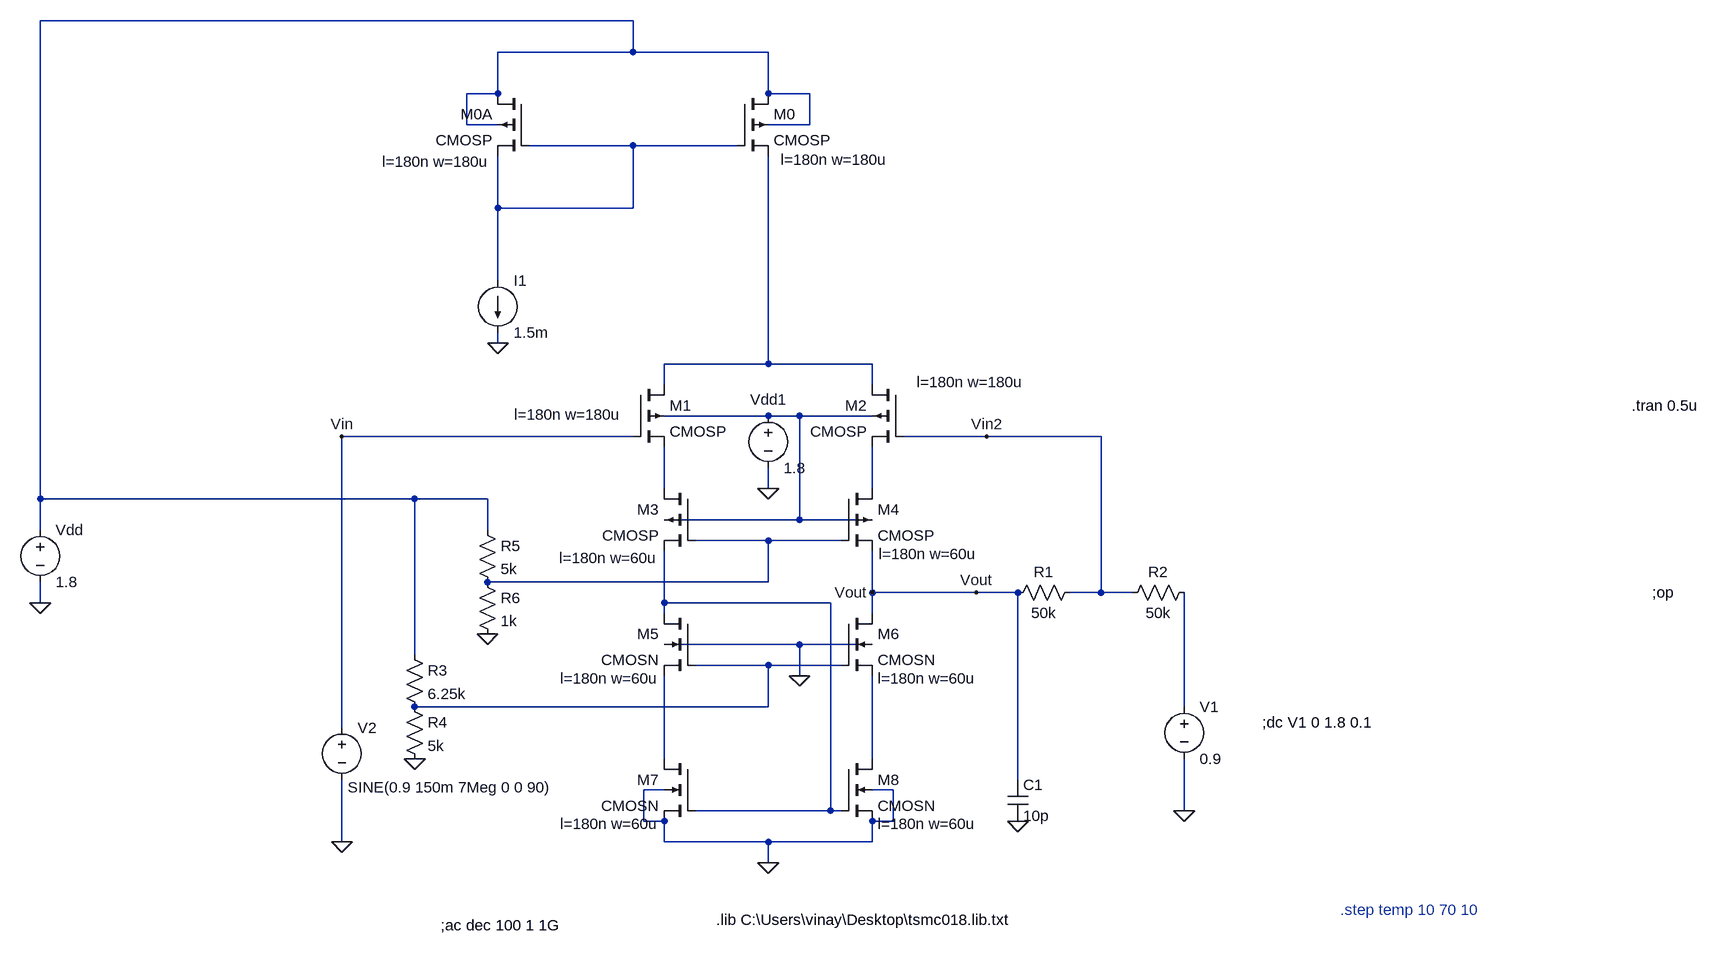
[diagram p0: schematic Differential_Amplifier.asc]
Differential_Amplifier.asc, the LTspice schematic file:
Version 4
SHEET 1 2008 752
WIRE -32 -784 -944 -784
WIRE -32 -736 -32 -784
WIRE -32 -736 -240 -736
WIRE 176 -736 -32 -736
WIRE -240 -672 -240 -736
WIRE -240 -672 -288 -672
WIRE 176 -672 176 -736
WIRE 240 -672 176 -672
WIRE -288 -624 -288 -672
WIRE -240 -624 -288 -624
WIRE 240 -624 240 -672
WIRE 240 -624 176 -624
WIRE -32 -592 -192 -592
WIRE 128 -592 -32 -592
WIRE -240 -496 -240 -576
WIRE -32 -496 -32 -592
WIRE -32 -496 -240 -496
WIRE -240 -384 -240 -496
WIRE -240 -288 -240 -304
WIRE 176 -256 176 -576
WIRE 176 -256 16 -256
WIRE 336 -256 176 -256
WIRE 16 -224 16 -256
WIRE 336 -224 336 -256
WIRE 176 -176 16 -176
WIRE 224 -176 176 -176
WIRE 336 -176 224 -176
WIRE -32 -144 -480 -144
WIRE 512 -144 384 -144
WIRE 688 -144 512 -144
WIRE 16 -64 16 -128
WIRE 176 -64 176 -96
WIRE 336 -64 336 -128
WIRE -944 -48 -944 -784
WIRE -368 -48 -944 -48
WIRE -256 -48 -368 -48
WIRE 224 -16 224 -176
WIRE 224 -16 16 -16
WIRE 336 -16 224 -16
WIRE -944 0 -944 -48
WIRE -256 0 -256 -48
WIRE 176 16 64 16
WIRE 288 16 176 16
WIRE 176 80 176 16
WIRE 176 80 -256 80
WIRE 336 96 336 32
WIRE 496 96 336 96
WIRE 560 96 496 96
WIRE 688 96 688 -144
WIRE 688 96 640 96
WIRE 736 96 688 96
WIRE -944 112 -944 80
WIRE 16 112 16 32
WIRE 272 112 16 112
WIRE 16 128 16 112
WIRE 336 128 336 96
WIRE 224 176 16 176
WIRE 336 176 224 176
WIRE -368 192 -368 -48
WIRE 176 208 64 208
WIRE 288 208 176 208
WIRE 224 224 224 176
WIRE 176 272 176 208
WIRE 176 272 -368 272
WIRE 816 272 816 96
WIRE -480 304 -480 -144
WIRE 16 352 16 224
WIRE 336 352 336 224
WIRE 560 384 560 96
WIRE 16 400 -16 400
WIRE 368 400 336 400
WIRE 272 432 272 112
WIRE 272 432 64 432
WIRE 288 432 272 432
WIRE 816 432 816 352
WIRE -16 448 -16 400
WIRE 16 448 -16 448
WIRE 368 448 368 400
WIRE 368 448 336 448
WIRE -480 480 -480 384
WIRE 16 480 16 448
WIRE 176 480 16 480
WIRE 336 480 336 448
WIRE 336 480 176 480
WIRE 176 512 176 480
FLAG 176 512 0
FLAG -944 112 0
FLAG 176 -64 0
FLAG 560 448 0
FLAG -480 480 0
FLAG 816 432 0
FLAG -240 -288 0
FLAG 224 224 0
FLAG -368 352 0
FLAG -256 160 0
FLAG -480 -144 Vin
FLAG 336 96 Vout
FLAG 496 96 Vout
FLAG 512 -144 Vin2
DATAFLAG -144 -144 ""
DATAFLAG -240 -496 ""
DATAFLAG 176 -320 ""
DATAFLAG 192 16 ""
DATAFLAG 336 -80 ""
DATAFLAG 16 -80 ""
DATAFLAG 336 80 ""
DATAFLAG 16 112 ""
DATAFLAG 144 208 ""
DATAFLAG 16 320 ""
DATAFLAG 336 304 ""
DATAFLAG 224 432 ""
SYMBOL current -240 -384 R0
WINDOW 123 0 0 Left 0
WINDOW 39 0 0 Left 0
SYMATTR InstName I1
SYMATTR Value 1.5m
SYMBOL nmos4 288 352 R0
WINDOW 123 56 100 Left 2
SYMATTR Value2 l=180n w=60u
SYMATTR InstName M8
SYMATTR Value CMOSN
SYMBOL nmos4 64 352 M0
WINDOW 123 56 100 Left 2
SYMATTR Value2 l=180n w=60u
SYMATTR InstName M7
SYMATTR Value CMOSN
SYMBOL pmos4 -32 -224 R0
WINDOW 123 -183 46 Left 2
SYMATTR Value2 l=180n w=180u
SYMATTR InstName M1
SYMATTR Value CMOSP
SYMBOL pmos4 384 -224 M0
WINDOW 123 -186 -4 Left 2
SYMATTR Value2 l=180n w=180u
SYMATTR InstName M2
SYMATTR Value CMOSP
SYMBOL voltage -944 -16 R0
WINDOW 123 0 0 Left 0
WINDOW 39 0 0 Left 0
SYMATTR InstName Vdd
SYMATTR Value 1.8
SYMBOL pmos4 128 -672 R0
WINDOW 123 67 102 Left 2
SYMATTR Value2 l=180n w=180u
SYMATTR InstName M0
SYMATTR Value CMOSP
SYMBOL pmos4 -192 -672 M0
WINDOW 123 60 105 Left 2
SYMATTR Value2 l=180n w=180u
SYMATTR InstName M0A
SYMATTR Value CMOSP
SYMBOL voltage 176 -192 R0
WINDOW 123 0 0 Left 0
WINDOW 39 0 0 Left 0
WINDOW 0 -28 -9 Left 2
SYMATTR InstName Vdd1
SYMATTR Value 1.8
SYMBOL voltage 816 256 R0
WINDOW 123 0 0 Left 0
WINDOW 39 0 0 Left 0
SYMATTR InstName V1
SYMATTR Value 0.9
SYMBOL voltage -480 288 R0
WINDOW 123 12 139 Left 2
WINDOW 39 0 0 Left 0
WINDOW 3 9 108 Left 2
SYMATTR Value SINE(0.9 150m 7Meg 0 0 90)
SYMATTR InstName V2
SYMBOL cap 544 384 R0
SYMATTR InstName C1
SYMATTR Value 10p
SYMBOL pmos4 288 -64 R0
WINDOW 123 58 101 Left 2
SYMATTR Value2 l=180n w=60u
SYMATTR InstName M4
SYMATTR Value CMOSP
SYMBOL pmos4 64 -64 M0
WINDOW 123 57 107 Left 2
SYMATTR Value2 l=180n w=60u
SYMATTR InstName M3
SYMATTR Value CMOSP
SYMBOL nmos4 64 128 M0
WINDOW 123 56 100 Left 2
SYMATTR Value2 l=180n w=60u
SYMATTR InstName M5
SYMATTR Value CMOSN
SYMBOL nmos4 288 128 R0
WINDOW 123 56 100 Left 2
SYMATTR Value2 l=180n w=60u
SYMATTR InstName M6
SYMATTR Value CMOSN
SYMBOL res -384 176 R0
SYMATTR InstName R3
SYMATTR Value 6.25k
SYMBOL res -384 256 R0
SYMATTR InstName R4
SYMATTR Value 5k
SYMBOL res -272 -16 R0
SYMATTR InstName R5
SYMATTR Value 5k
SYMBOL res -272 64 R0
SYMATTR InstName R6
SYMATTR Value 1k
SYMBOL res 656 80 R90
WINDOW 0 0 56 VBottom 2
WINDOW 3 32 56 VTop 2
SYMATTR InstName R1
SYMATTR Value 50k
SYMBOL res 832 80 R90
WINDOW 0 0 56 VBottom 2
WINDOW 3 32 56 VTop 2
SYMATTR InstName R2
SYMATTR Value 50k
TEXT 96 600 Left 2 !.lib C:\\Users\\vinay\\Desktop\\tsmc018.lib.txt
TEXT -328 608 Left 2 !;ac dec 100 1 1G
TEXT 1536 96 Left 2 !;op
TEXT 1504 -192 Left 2 !.tran 0.5u
TEXT 936 296 Left 2 !;dc V1 0 1.8 0.1
TEXT 1056 584 Left 2 ;.step temp 10 70 10

The netlist it stands for:
* Differential_Amplifier.asc
I1 N002 0 1.5m
M8 N012 N008 0 0 CMOSN l=180n w=60u
M7 N011 N008 0 0 CMOSN l=180n w=60u
M1 N003 Vin N005 N004 CMOSP l=180n w=180u
M2 N003 Vin2 N006 N004 CMOSP l=180n w=180u
Vdd N001 0 1.8
M0 N001 N002 N003 N001 CMOSP l=180n w=180u
M0A N001 N002 N002 N001 CMOSP l=180n w=180u
Vdd1 N004 0 1.8
V1 N010 0 0.9
V2 Vin 0 SINE(0.9 150m 7Meg 0 0 90)
C1 Vout 0 10p
M4 N006 N007 Vout N004 CMOSP l=180n w=60u
M3 N005 N007 N008 N004 CMOSP l=180n w=60u
M5 N008 N009 N011 0 CMOSN l=180n w=60u
M6 Vout N009 N012 0 CMOSN l=180n w=60u
R3 N001 N009 6.25k
R4 N009 0 5k
R5 N001 N007 5k
R6 N007 0 1k
R1 Vin2 Vout 50k
R2 N010 Vin2 50k
.model NMOS NMOS
.model PMOS PMOS
.lib standard.mos
.lib C:\Users\vinay\Desktop\tsmc018.lib.txt
;ac dec 100 1 1G
;op
.tran 0.5u
;dc V1 0 1.8 0.1
* .step temp 10 70 10
.backanno
.end